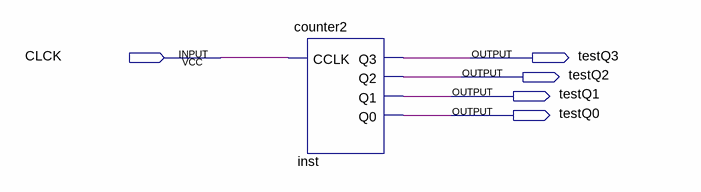
[diagram p0: schematic sheet]
// Quartus schematic test1.bdf as structural Verilog: 1 symbols, 5 pins
module test1 (
  input  CLCK,
  output testQ3,
  output testQ2,
  output testQ1,
  output testQ0
);

  counter2 inst (.CCLK(CLCK), .Q3(testQ3), .Q2(testQ2), .Q1(testQ1), .Q0(testQ0));
endmodule
